# Altium schematic sheet GPIO.SchDoc
size A
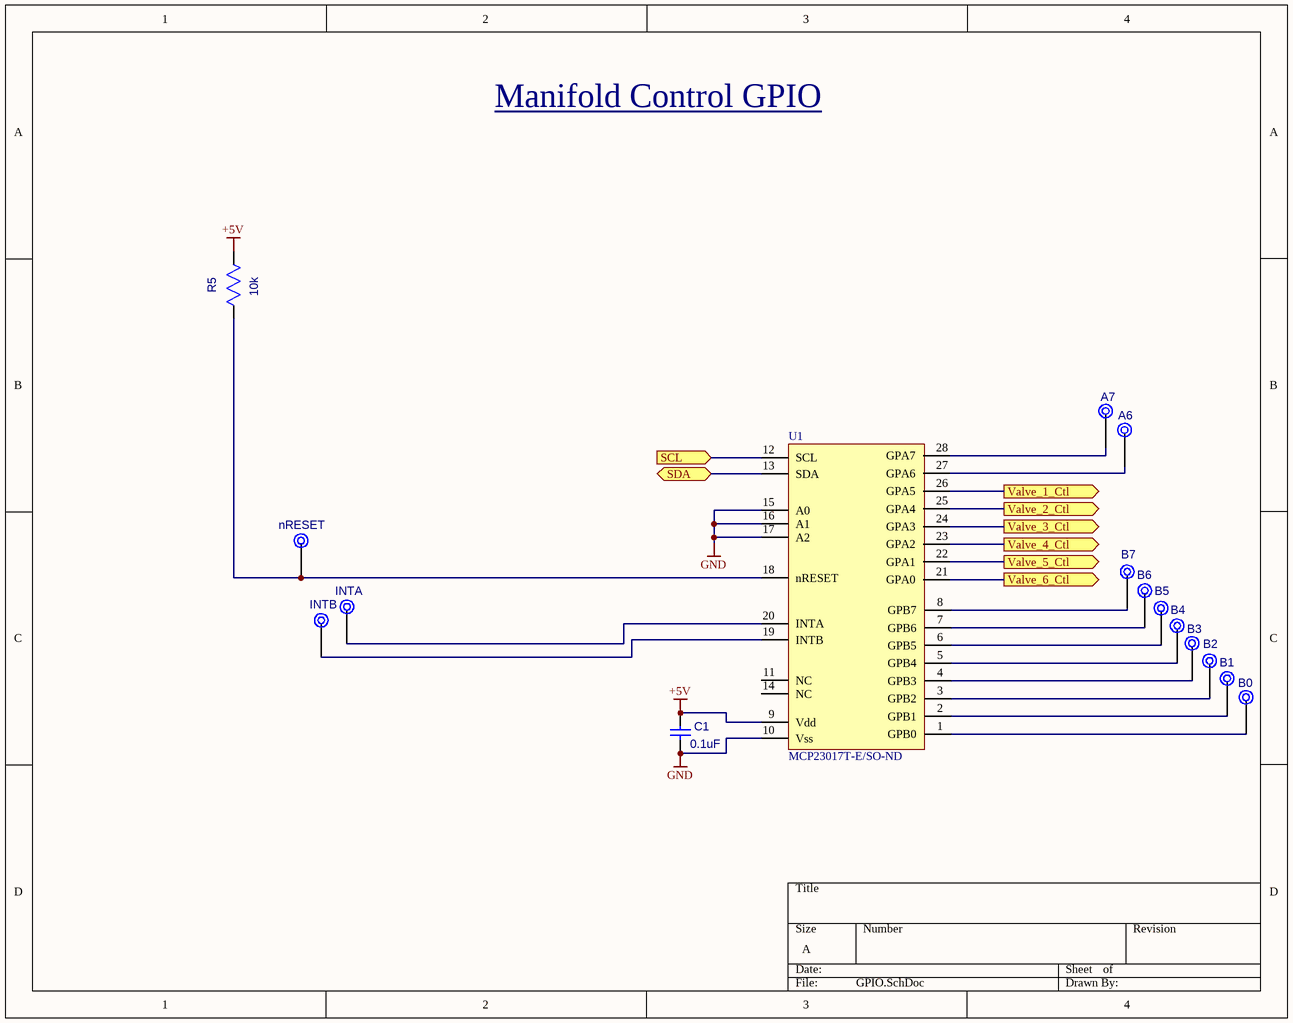
[diagram p0: GPIO.SchDoc]

## Parts
C1  value 0.1uF  [CC1206]  (hidden comment: CC1206)
R5  value 10k  [RC1206]  (hidden comment: RC1206)
TP1  A6  [PAD_SMALL]
TP2  A7  [PAD_SMALL]
TP3  B0  [PAD_SMALL]
TP4  B1  [PAD_SMALL]
TP5  B2  [PAD_SMALL]
TP6  B3  [PAD_SMALL]
TP7  B4  [PAD_SMALL]
TP8  B5  [PAD_SMALL]
TP9  B6  [PAD_SMALL]
TP10  B7  [PAD_SMALL]
TP11  nRESET  [PAD_SMALL]
TP12  INTA  [PAD_SMALL]
TP13  INTB  [PAD_SMALL]
U1  Supplier Part Number 1: MCP23017T-E/SO-ND  [SOP28]  (hidden comment: MCP23017-E/SO)

## Ports
SCL (in), SDA, Valve_1_Ctl (out), Valve_2_Ctl (out), Valve_3_Ctl (out), Valve_4_Ctl (out), Valve_5_Ctl (out), Valve_6_Ctl (out)

## Nets
+5V: C1.1 R5.1 U1.9(Vdd)
GND: C1.2 U1.10(Vss) U1.15(A0) U1.16(A1) U1.17(A2)
SCL: U1.12(SCL) ; port SCL
SDA: U1.13(SDA) ; port SDA
Valve_1_Ctl: U1.26(GPA5) ; port Valve_1_Ctl
Valve_2_Ctl: U1.25(GPA4) ; port Valve_2_Ctl
Valve_3_Ctl: U1.24(GPA3) ; port Valve_3_Ctl
Valve_4_Ctl: U1.23(GPA2) ; port Valve_4_Ctl
Valve_5_Ctl: U1.22(GPA1) ; port Valve_5_Ctl
Valve_6_Ctl: U1.21(GPA0) ; port Valve_6_Ctl
NetR5_2: R5.2 TP11.TP U1.18(nRESET)
NetTP1_TP: TP1.TP U1.27(GPA6)
NetTP2_TP: TP2.TP U1.28(GPA7)
NetTP3_TP: TP3.TP U1.1(GPB0)
NetTP4_TP: TP4.TP U1.2(GPB1)
NetTP5_TP: TP5.TP U1.3(GPB2)
NetTP6_TP: TP6.TP U1.4(GPB3)
NetTP7_TP: TP7.TP U1.5(GPB4)
NetTP8_TP: TP8.TP U1.6(GPB5)
NetTP9_TP: TP9.TP U1.7(GPB6)
NetTP10_TP: TP10.TP U1.8(GPB7)
NetTP12_TP: TP12.TP U1.20(INTA)
NetTP13_TP: TP13.TP U1.19(INTB)

Not connected (* = marked no-connect by the designer): U1 11(NC) 14(NC)

## Notes on the sheet
- Manifold Control GPIO

## Library data of the parts
TP1-TP13 = PAD: Test Point; Value: *
U1 = MCP23017-E/SO: Manufacturer: Microchip Technology; Manufacturer Part Number: MCP23017T-E/SO; Number of I/O: 16; Interface: I²C; Interrupt Output: Yes; Output Type: Push-Pull; Current - Output Source/Sink: 25mA; Frequency - Clock: 1.7MHz; Voltage - Supply: 1.8 V ~ 5.5 V; Supplier 1: Digi-Key; RoHS: RoHS Compliant; Category: Integrated Circuits (ICs); Stock 1: 0; Pricing 1: 1600=0.91 (USD); Packaging: Tape & Reel (TR); Features: POR; Operating Temperature: -40°C ~ 125°C; Mounting Type: Surface Mount; Package / Case: 28-SOIC (0.295", 7.50mm Width); Supplier Device Package: 28-SOIC; ComponentLink1URL: http://www.microchip.com/mymicrochip/filehandler.aspx?ddocname=en023709; ComponentLink1Description: http://www.microchip.com/mymicrochip/filehandler.aspx?ddocname=en023709